# Altium schematic sheet IP2363_DEMO_V1.10.schdoc
size 452 x 282 mm
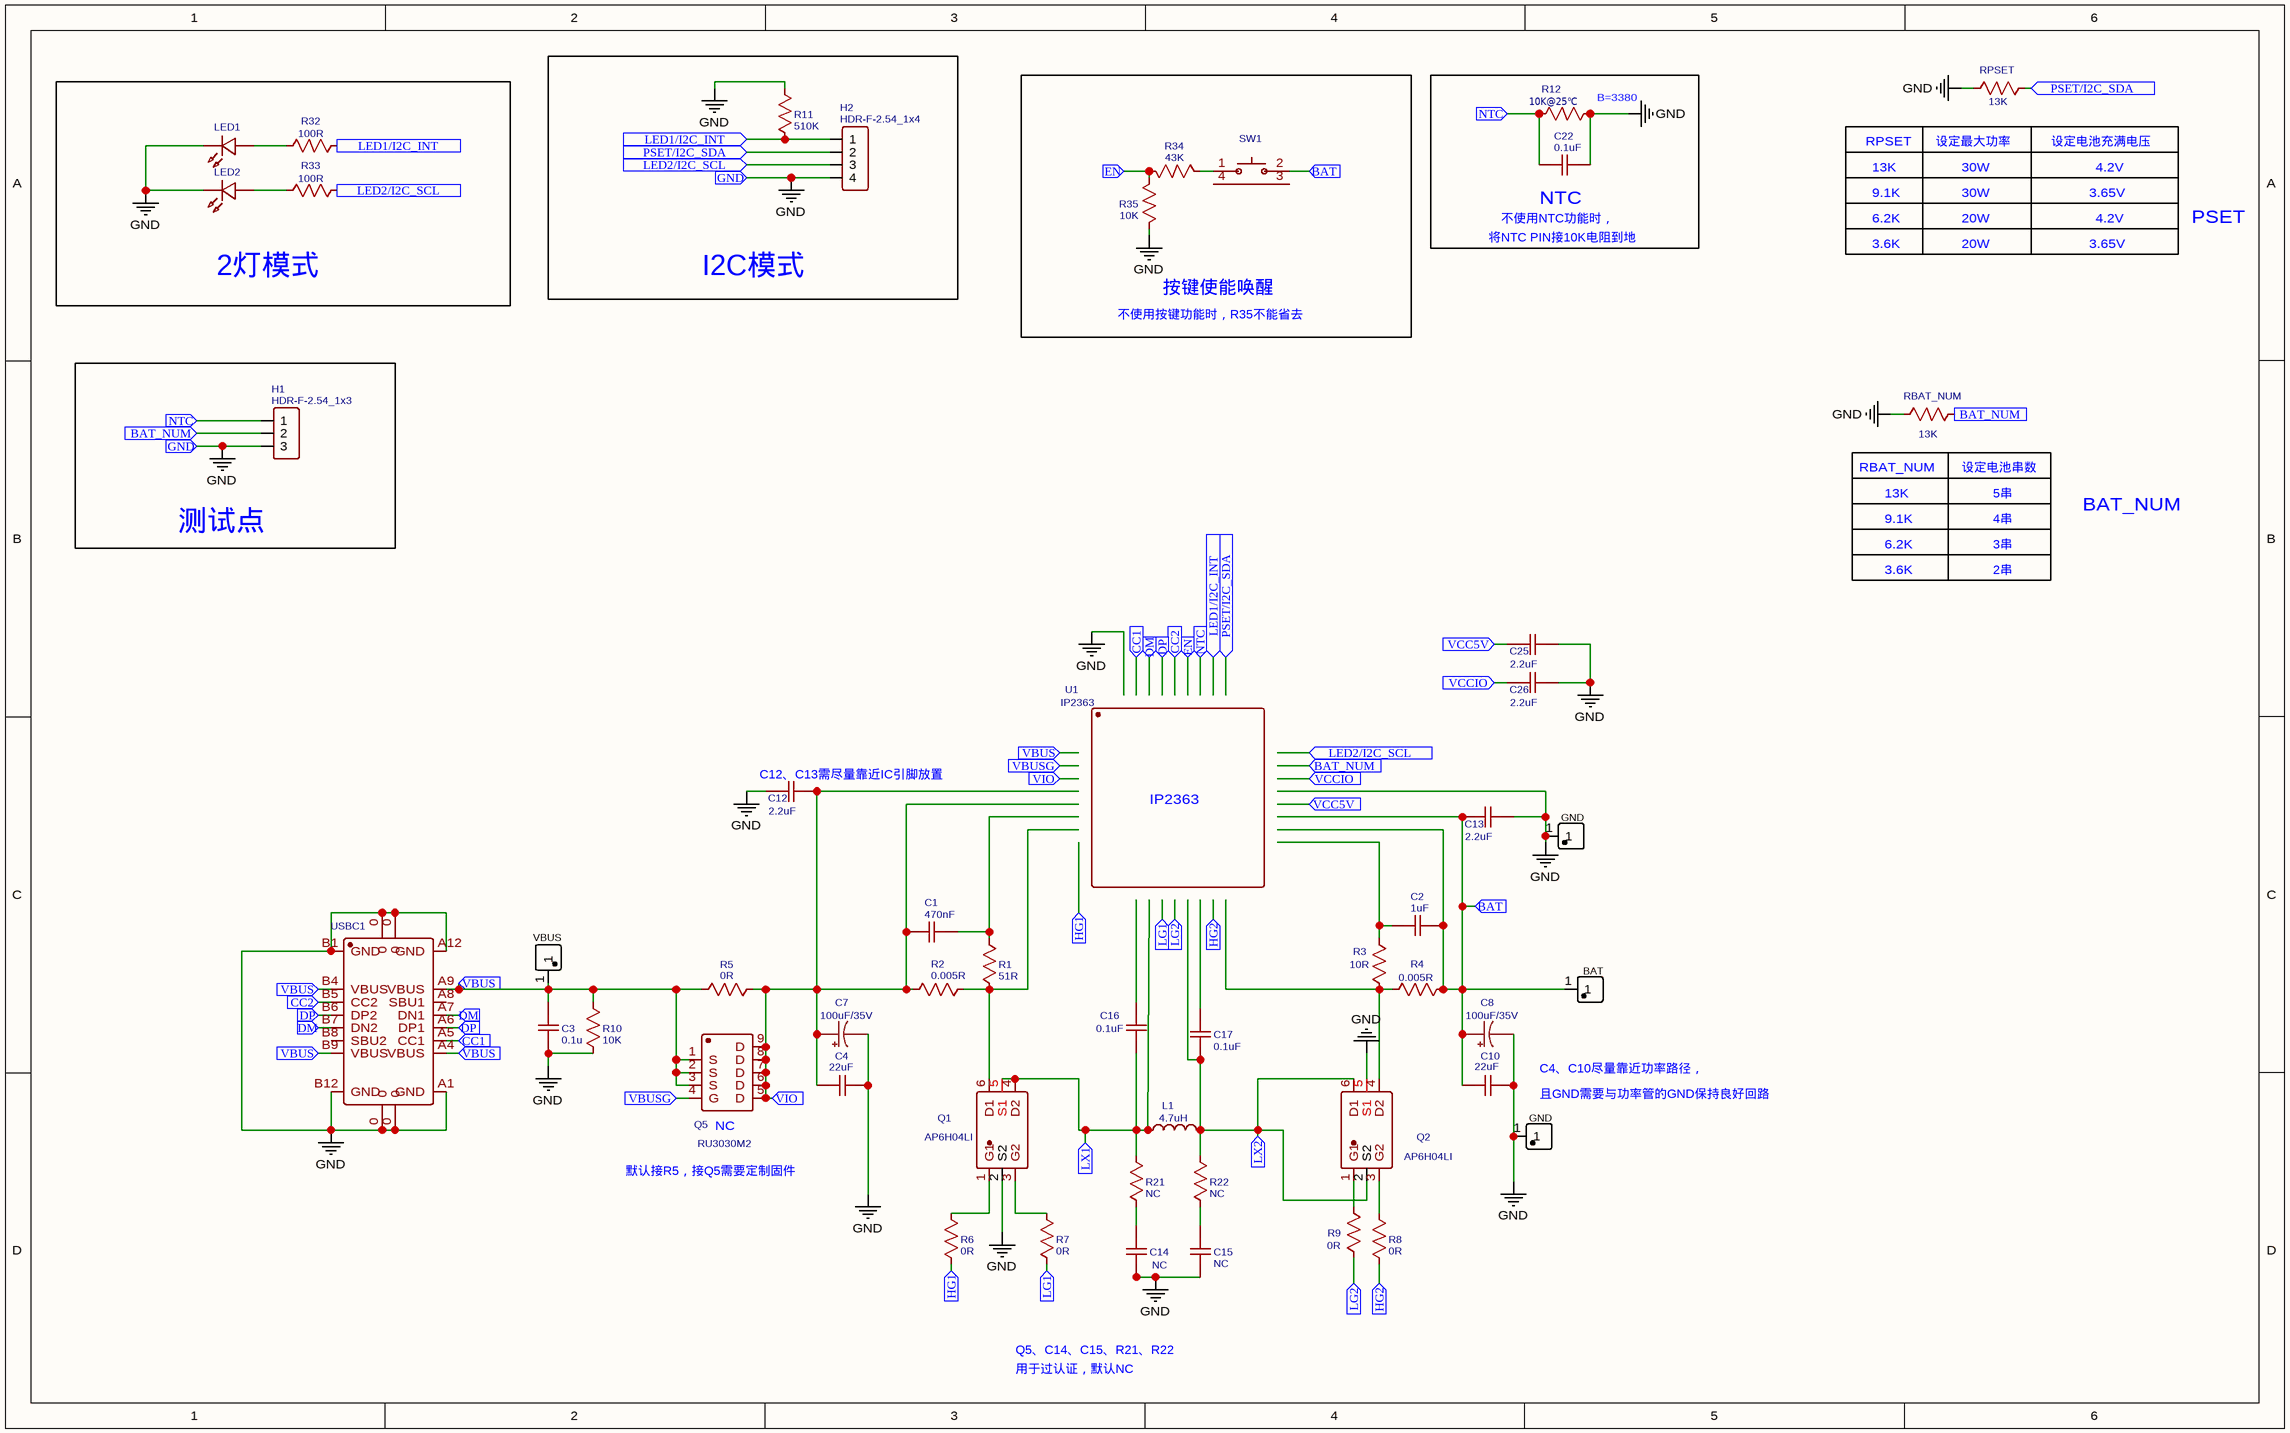
[diagram p0: IP2363_DEMO_V1.10.schdoc]

## Parts
C1  470nF  [C0603]
C2  1uF  [C0603]
C3  0.1u  [C0603]
C4  22uF  [C1206]
C7  100uF/35V  [CAP-D6.3-F2.5]
C8  100uF/35V  [CAP-D6.3-F2.5]
C10  22uF  [C1206]
C12  2.2uF  [C0603]
C13  2.2uF  [C0603]
C14  NC  [C0603]
C15  NC  [C0603]
C16  0.1uF  [C0603]
C17  0.1uF  [C0603]
C22  0.1uF  [C0603]
C25  2.2uF  [C0603]
C26  2.2uF  [C0603]
H1  HDR-F-2.54_1x3  [HDR-F-2.54_1X3]
H2  HDR-F-2.54_1x4  [HDR-F-2.54_1X4]
L1  4.7uH  [IND-SMD_L12.6-W13.5]
LED1  LED-0603_B  [LED0603_BLUE]  (value not drawn)
LED2  LED-0603_B  [LED0603_BLUE]  (value not drawn)
Q1  AP6H04LI  [SOT-23-6_L2.9-W1.6-P0.95-LS2.8-BR]
Q2  AP6H04LI  [SOT-23-6_L2.9-W1.6-P0.95-LS2.8-BR]
Q5  RU3030M2  [PDFN3333-8_L3.1-W3.2-P0.65-LS3.4-BL]
R1  51R  [R0603]
R2  0.005R  [R1206]
R3  10R  [R0603]
R4  0.005R  [R1206]
R5  0R  [R1206]
R6  0R  [R0603]
R7  0R  [R0603]
R8  0R  [R0603]
R9  0R  [R0603]
R10  10K  [R0603]
R11  510K  [R0603]
R12  10K@25℃  [R0603]
R21  NC  [R0603]
R22  NC  [R0603]
R32  100R  [R0603]
R33  100R  [R0603]
R34  43K  [R0603]
R35  10K  [R0603]
RBAT_NUM  13K  [R0603]
RPSET  13K  [R0603]
SW1  1TS002G-1900-3500-CT  [KEY-SMD_1TS002G]  (value not drawn)
U1  IP2363  [QFN-32_L5.0-W5.0-P0.50-TL-EP3.4]
U2  VBUS  [TESTPOINT-TH_BD3.2]
U3  GND  [TESTPOINT-TH_BD3.2]
U4  BAT  [TESTPOINT-TH_BD3.2]
U5  GND  [TESTPOINT-TH_BD3.2]
USBC1  TYPE-C-31-M-12  [USB-C_SMD-TYPE-C-31-M-12]  (value not drawn)

## Blocks framed on the sheet
I2C模式: H2 R11
2灯模式: LED1 LED2 R32 R33
按键使能唤醒: R34 R35 SW1
NTC: C22 R12
测试点: H1

## Ports
BAT (in), BAT_NUM (in), CC1 (in), CC2 (in), DM (in), DP (in), EN (in), GND (in), HG1 (in), HG2 (in), LED1/I2C_INT (in), LED2/I2C_SCL (in), LG1 (in), LG2 (in), LX1 (in), LX2 (in), NTC (in), PSET/I2C_SDA (in), VBUS (in), VBUSG (in), VCC5V (in), VCCIO (in), VIO (in)

## Nets
GND: C3.1 C4.2 C7.2 C8.2 C10.2 C12.1 C13.2 C14.2 C15.2 C22.2 C25.2 C26.2 H1.3 H2.4 LED1.2 LED2.2 Q1.2(S2) Q2.5(S1) R10.2 R11.1 R12.1 R35.2 RBAT_NUM.1 RPSET.1 U3.1 U5.1 USBC1.0 USBC1.A1(GND) USBC1.A12(GND) USBC1.B1(GND) USBC1.B12(GND) ; port GND
BAT: C2.2 C8.1 C10.1 C13.1 R4.2 SW1.2 U4.1 ; port BAT
BAT_NUM: H1.2 RBAT_NUM.2 ; port BAT_NUM
CC1: USBC1.A5(CC1) ; port CC1
CC2: USBC1.B5(CC2) ; port CC2
DM: USBC1.A7(DN1) USBC1.B7(DN2) ; port DM
DP: USBC1.A6(DP1) USBC1.B6(DP2) ; port DP
EN: R34.1 R35.1 ; port EN
HG1: R6.2 ; port HG1
HG2: R8.2 ; port HG2
LED1/I2C_INT: H2.1 R11.2 R32.1 ; port LED1/I2C_INT
LED2/I2C_SCL: H2.3 R33.1 ; port LED2/I2C_SCL
LG1: R7.2 ; port LG1
LG2: R9.2 ; port LG2
LX1: C16.2 L1.1 Q1.4(D2) Q1.5(S1) R21.2 ; port LX1
LX2: C17.2 L1.2 Q2.2(S2) Q2.6(D1) R22.2 ; port LX2
NTC: C22.1 H1.1 R12.2 ; port NTC
PSET/I2C_SDA: H2.2 RPSET.2 ; port PSET/I2C_SDA
VBUS: C3.2 Q5.1(S) Q5.2(S) Q5.3(S) R5.1 R10.1 U2.1 USBC1.A4(VBUS) USBC1.A9(VBUS) USBC1.B4(VBUS) USBC1.B9(VBUS) ; port VBUS
VBUSG: Q5.4(G) ; port VBUSG
VCC5V: C25.1 ; port VCC5V
VCCIO: C26.1 ; port VCCIO
VIO: C1.1 C4.1 C7.1 C12.2 Q5.5(D) Q5.6(D) Q5.7(D) Q5.8(D) Q5.9(D) R2.1 R5.2 ; port VIO
NetC1_2: C1.2 R1.2
NetC2_1: C2.1 R3.2
NetC14_1: C14.1 R21.1
NetC15_1: C15.1 R22.1
NetLED1_1: LED1.1 R32.2
NetLED2_1: LED2.1 R33.2
NetQ1_1: Q1.1(G1) R6.1
NetQ1_3: Q1.3(G2) R7.1
NetQ1_6: Q1.6(D1) R1.1 R2.2
NetQ2_1: Q2.1(G1) R9.1
NetQ2_3: Q2.3(G2) R8.1
NetQ2_4: Q2.4(D2) R3.1 R4.1
NetR34_2: R34.2 SW1.1

Not connected (* = marked no-connect by the designer): C16 1; C17 1; SW1 3 4; USBC1 A8(SBU1) B8(SBU2)

## Notes on the sheet
- (near R12) B=3380
- RPSET
- 13K
- (near RPSET) 设定最大功率
- 30W
- 设定电池充满电压
- 4.2V
- (near C22) 不使用NTC功能时，
- 6.2K
- 9.1K
- 20W
- 3.65V
- PSET
- 将NTC PIN接10K电阻到地
- 3.6K
- 不使用按键功能时，R35不能省去
- (near RBAT_NUM) RBAT_NUM
- (near RBAT_NUM) 设定电池串数
- 3串
- 4串
- 5串
- BAT_NUM
- 2串
- (near C12) C12、C13需尽量靠近IC引脚放置
- C4、C10尽量靠近功率路径，
- (near Q5) NC
- 且GND需要与功率管的GND保持良好回路
- 默认接R5，接Q5需要定制固件
- 用于过认证，默认NC
- Q5、C14、C15、R21、R22

## Library data of the parts
C1 = 470nF: nameAlias: Value(F); Contributor: LCEDA_Lib; spicePre: C; spiceSymbolName: C_0603_US
C2 = 1uF: nameAlias: Value(F); Contributor: LCEDA_Lib; spicePre: C; spiceSymbolName: C_0603_US
C3 = 0.1u: nameAlias: Value(F); Contributor: LCEDA_Lib; spicePre: C; spiceSymbolName: C_0603_US
C4 C10 = 22uF: nameAlias: Value(F); Contributor: LCEDA_Lib; spicePre: C; spiceSymbolName: C_1206_US
C7 C8 = 100uF/35V: BOM_Manufacturer: BERYL Electronic Tech; BOM_Manufacturer Part: RC050M4R7LO5*11TH-2A1E; nameAlias: Capacitance; Contributor: s-dawn; BOM_Supplier: LCSC; BOM_Supplier Part: C365767; BOM_JLCPCB Part Class: Extended Part; spicePre: C; spiceSymbolName: C1
C12 C13 C25 C26 = 2.2uF: nameAlias: Value(F); Contributor: LCEDA_Lib; spicePre: C; spiceSymbolName: C_0603_US
C14 C15 = NC: nameAlias: Value(F); Contributor: LCEDA_Lib; spicePre: C; spiceSymbolName: C_0603_US
C16 C17 C22 = 0.1uF: nameAlias: Value(F); Contributor: LCEDA_Lib; spicePre: C; spiceSymbolName: C_0603_US
H1 = HDR-F-2.54_1x3: Contributor: LCEDA_Lib; BOM_Supplier Part: C146690; BOM_Supplier: LCSC; spicePre: H; spiceSymbolName: HDR-F-2.54_1x3
H2 = HDR-F-2.54_1x4: Contributor: LCEDA_Lib; BOM_Supplier Part: C225501; BOM_Supplier: LCSC; spicePre: H; spiceSymbolName: HDR-F-2.54_1x4
L1 = 4.7uH: BOM_Manufacturer: cjiang(长江微电); BOM_Manufacturer Part: FXL1350-4R7-M; nameAlias: Inductance; Contributor: LCSC; BOM_Supplier: LCSC; BOM_Supplier Part: C526015; BOM_JLCPCB Part Class: Extended Part; spicePre: L; spiceSymbolName: FXL1350-4R7-M
LED1 LED2 = LED-0603_B: BOM_Manufacturer: EVERLIGHT(台湾亿光); BOM_Manufacturer Part: 19-217/BHC-ZL1M2RY/3T; Contributor: LCEDA_01; BOM_Supplier Part: C72041; BOM_Supplier: LCSC; spicePre: L; spiceSymbolName: LED-0603_B
Q1 Q2 = AP6H04LI: Contributor: it809; spicePre: U; spiceSymbolName: AP6H04LI
Q5 = RU3030M2: BOM_Manufacturer: Ruichips; Contributor: LCSC; BOM_Supplier: LCSC; BOM_Manufacturer Part: RU3030M2; BOM_Supplier Part: C180957; BOM_JLCPCB Part Class: Extended Part; spicePre: Q; spiceSymbolName: RU3030M2
R1 = 51R: nameAlias: Value(Ω); Contributor: LCEDA_Lib; spicePre: R; spiceSymbolName: R_0603_US
R2 R4 = 0.005R: nameAlias: Value(Ω); Contributor: LCEDA_Lib; spicePre: R; spiceSymbolName: R_1206_US
R3 = 10R: nameAlias: Value(Ω); Contributor: LCEDA_Lib; spicePre: R; spiceSymbolName: R_0603_US
R5-R9 = 0R: nameAlias: Value(Ω); Contributor: LCEDA_Lib; spicePre: R
  R5: spiceSymbolName: R_1206_US
  R6-R9: spiceSymbolName: R_0603_US
R10 R35 = 10K: nameAlias: Value(Ω); Contributor: LCEDA_Lib; spicePre: R; spiceSymbolName: R_0603_US
R11 = 510K: nameAlias: Value(Ω); Contributor: LCEDA_Lib; spicePre: R; spiceSymbolName: R_0603_US
R12 = 10K@25℃: nameAlias: Value(Ω); Contributor: LCEDA_Lib; spicePre: R; spiceSymbolName: R_0603_US
R21 R22 = NC: nameAlias: Value(Ω); Contributor: LCEDA_Lib; spicePre: R; spiceSymbolName: R_0603_US
R32 R33 = 100R: nameAlias: Value(Ω); Contributor: LCEDA_Lib; spicePre: R; spiceSymbolName: R_0603_US
R34 = 43K: nameAlias: Value(Ω); Contributor: LCEDA_Lib; spicePre: R; spiceSymbolName: R_0603_US
RBAT_NUM RPSET = 13K: nameAlias: Value(Ω); Contributor: LCEDA_Lib; spicePre: R; spiceSymbolName: R_0603_US
SW1 = 1TS002G-1900-3500-CT: BOM_Manufacturer: HYP; Contributor: LCSC; BOM_Supplier: LCSC; BOM_Supplier Part: C319376; BOM_Manufacturer Part: 1TS002G-1900-3500-CT; BOM_JLCPCB Part Class: Extended Part; spicePre: S; spiceSymbolName: 1TS002G-1900-3500-CT
U1 = IP2363: Contributor: cong24; spicePre: U; spiceSymbolName: IP2363
U2 = VBUS: BOM_Manufacturer: null; BOM_Manufacturer Part: TP-红色测试点; Contributor: lcsc; BOM_Supplier: LCSC; BOM_Supplier Part: C9900007423; link: https://atta.szlcsc.comnull; BOM_JLCPCB Part Class: Extended Part; spicePre: U; spiceSymbolName: TP-红色测试点
U3 U5 = GND: BOM_Manufacturer: null; BOM_Manufacturer Part: TP-红色测试点; Contributor: lcsc; BOM_Supplier: LCSC; BOM_Supplier Part: C9900007423; link: https://atta.szlcsc.comnull; BOM_JLCPCB Part Class: Extended Part; spicePre: U; spiceSymbolName: TP-红色测试点
U4 = BAT: BOM_Manufacturer: null; BOM_Manufacturer Part: TP-红色测试点; Contributor: lcsc; BOM_Supplier: LCSC; BOM_Supplier Part: C9900007423; link: https://atta.szlcsc.comnull; BOM_JLCPCB Part Class: Extended Part; spicePre: U; spiceSymbolName: TP-红色测试点
USBC1 = TYPE-C-31-M-12: BOM_Manufacturer: Rectangular Connectors - Contacts; Contributor: LCSC; BOM_Supplier: LCSC; BOM_Supplier Part: C165948; BOM_Manufacturer Part: TYPE-C-31-M-12; spicePre: U; spiceSymbolName: TYPE-C-31-M-12